# Altium schematic sheet TP_STD_PERIPHERALS.SchDoc
size A4; SheetNumber: 9; SheetTotal: 11
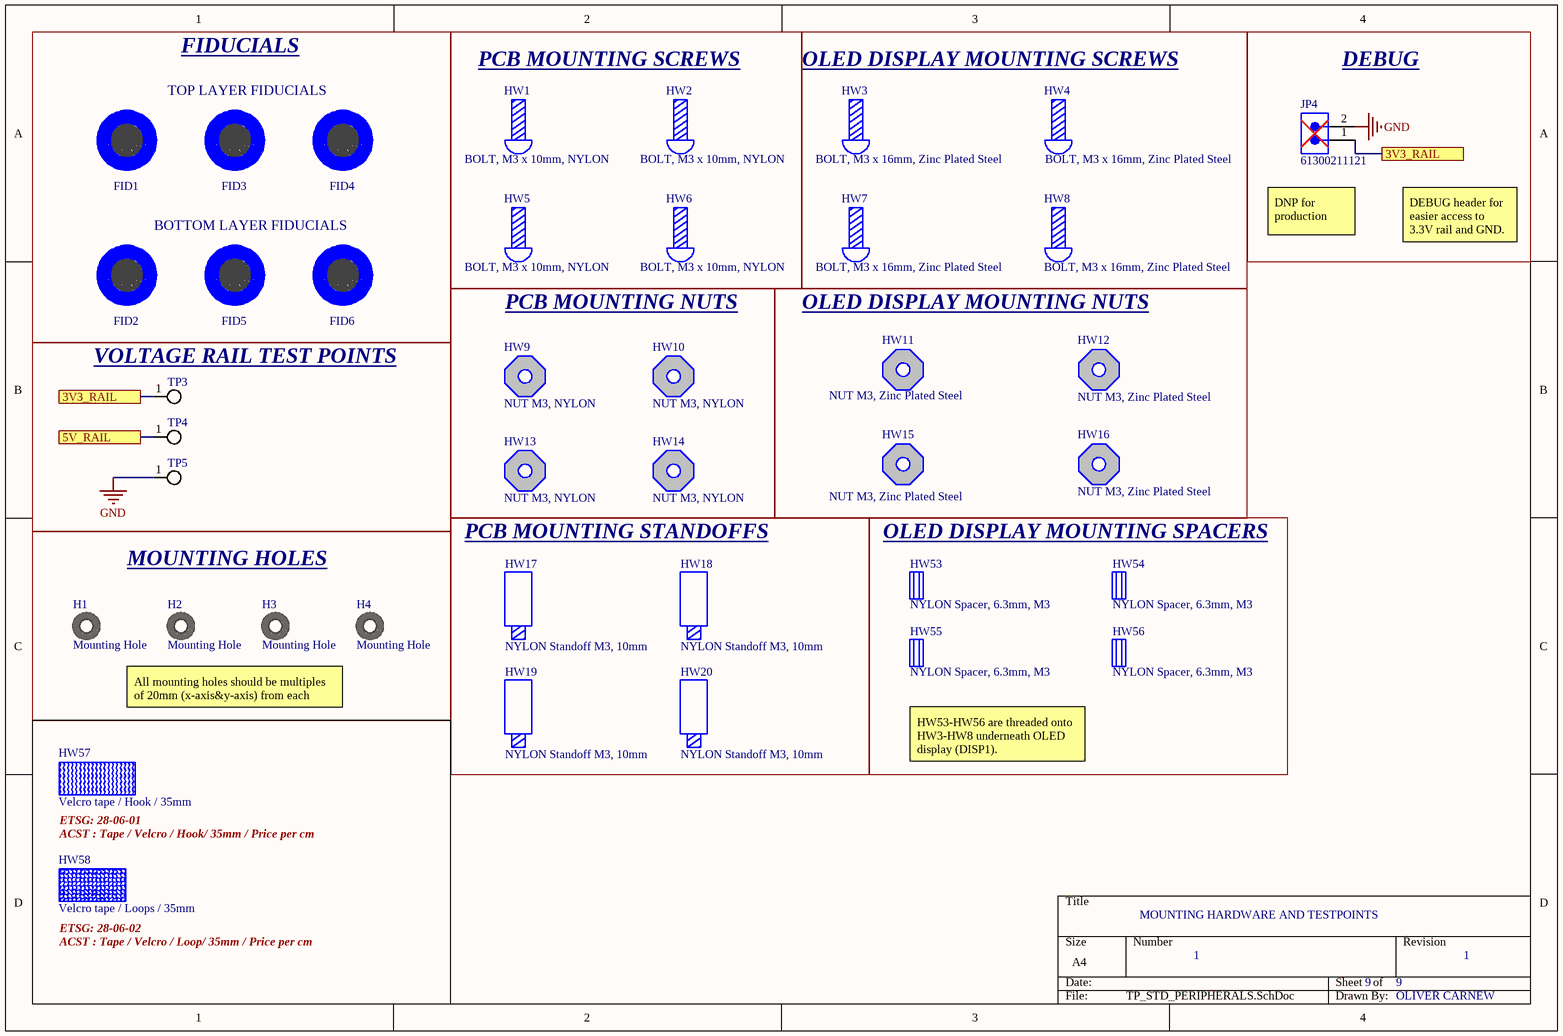
[diagram p0: TP_STD_PERIPHERALS.SchDoc]

## Parts
*  NC  (value not drawn)
FID1  Fiducial Mark  [FIDUCIAL_SMALL]  (value not drawn)
FID2  Fiducial Mark  [FIDUCIAL_SMALL]  (value not drawn)
FID3  Fiducial Mark  [FIDUCIAL_SMALL]  (value not drawn)
FID4  Fiducial Mark  [FIDUCIAL_SMALL]  (value not drawn)
FID5  Fiducial Mark  [FIDUCIAL_SMALL]  (value not drawn)
FID6  Fiducial Mark  [FIDUCIAL_SMALL]  (value not drawn)
H1  Mounting Hole  [M3_MOUNTING_HOLE_3_4_mm]
H2  Mounting Hole  [M3_MOUNTING_HOLE_3_4_mm]
H3  Mounting Hole  [M3_MOUNTING_HOLE_3_4_mm]
H4  Mounting Hole  [M3_MOUNTING_HOLE_3_4_mm]
HW1  BOLT, M3 x 10mm, NYLON
HW2  BOLT, M3 x 10mm, NYLON
HW3  BOLT, M3 x 16mm, Zinc Plated Steel
HW4  BOLT, M3 x 16mm, Zinc Plated Steel
HW5  BOLT, M3 x 10mm, NYLON
HW6  BOLT, M3 x 10mm, NYLON
HW7  BOLT, M3 x 16mm, Zinc Plated Steel
HW8  BOLT, M3 x 16mm, Zinc Plated Steel
HW9  NUT M3, NYLON
HW10  NUT M3, NYLON
HW11  NUT M3, Zinc Plated Steel
HW12  NUT M3, Zinc Plated Steel
HW13  NUT M3, NYLON
HW14  NUT M3, NYLON
HW15  NUT M3, Zinc Plated Steel
HW16  NUT M3, Zinc Plated Steel
HW17  NYLON Standoff M3, 10mm
HW18  NYLON Standoff M3, 10mm
HW19  NYLON Standoff M3, 10mm
HW20  NYLON Standoff M3, 10mm
HW53  NYLON Spacer, 6.3mm, M3
HW54  NYLON Spacer, 6.3mm, M3
HW55  NYLON Spacer, 6.3mm, M3
HW56  NYLON Spacer, 6.3mm, M3
HW57  Velcro tape / Hook / 35mm
HW58  Velcro tape / Loops / 35mm
JP4  61300211121  [61300211121]
TP3  Small testpoint 40mil  [TEST_POINT_SMALL]  (value not drawn)
TP4  Small testpoint 40mil  [TEST_POINT_SMALL]  (value not drawn)
TP5  Small testpoint 40mil  [TEST_POINT_SMALL]  (value not drawn)

## Blocks framed on the sheet
FIDUCIALS: FID1-FID6
PCB MOUNTING SCREWS: HW1 HW2 HW5 HW6
OLED DISPLAY MOUNTING SCREWS: HW3 HW4 HW7 HW8
DEBUG: * JP4
PCB MOUNTING NUTS: HW9 HW10 HW13 HW14
OLED DISPLAY MOUNTING NUTS: HW11 HW12 HW15 HW16
VOLTAGE RAIL TEST POINTS: TP3-TP5
PCB MOUNTING STANDOFFS: HW17-HW20
OLED DISPLAY MOUNTING SPACERS: HW53-HW56
MOUNTING HOLES: H1-H4

## Ports
3V3_RAIL, 5V_RAIL

## Nets
GND: JP4.2 TP5.1
3V3_RAIL: JP4.1 TP3.1 ; port 3V3_RAIL
5V_RAIL: TP4.1 ; port 5V_RAIL

## Notes on the sheet
- TOP LAYER FIDUCIALS
- BOTTOM LAYER FIDUCIALS
- DNP for production
- DEBUG header for easier access to 3.3V rail and GND.
- All mounting holes should be multiples of 20mm (x-axis&y-axis) from each other.
- HW53-HW56 are threaded onto HW3-HW8 underneath OLED display (DISP1).
- (near HW57) ETSG: 28-06-01
- (near HW57) ACST : Tape / Velcro / Hook/ 35mm / Price per cm
- MOUNTING HARDWARE AND TESTPOINTS
- (near HW58) ETSG: 28-06-02
- (near HW58) ACST : Tape / Velcro / Loop/ 35mm / Price per cm
- 1
- 9
- OLIVER CARNEW

## Library data of the parts
FID1-FID6 = FIDUCIAL_SMALL: Small 1mm/40mil pad with 40mm soldermask clearance
H1-H4 = M3_MOUNTING_HOLE: M3 Mounting hole (3.4mm)
HW1-HW8 = M3_SCREW
HW9-HW16 = NUT
HW17-HW20 = STANDOFF
HW53-HW56 = NYLON_STANDOFF_6_3_mm: Spacer / Female - Female / Nylon / Hexagonal / M3 x 06.3
HW57 = VELCRO_HOOKS: ETSG: 28-06-01 / ACST : Tape / Velcro / Hook / / 20mm / Price per cm
HW58 = VELCRO_LOOP: ETSG: 28-06-01 / ACST : Tape / Velcro / Hook / / 20mm / Price per cm
JP4 = CMP-1712-00002-6: NexarPartId: 20081794; Number of Contacts: 2; Pitch: 2.54mm; Connector Type: Male Pin; Voltage Rating: 250V; Current Rating: 3A; Gender: Male; Contact Resistance: 20mΩ; Height: 8.94mm; Lead Free: Lead Free; Number of Pins: 2; Termination: Through Hole; RoHS: Compliant; Lead Pitch: 2.54mm; REACH SVHC: No SVHC; Housing Material: PBT; Contact Mating Length: 5.9944mm; Min Operating Temperature: -40°C; Orientation: Vertical; Contact Material: Copper; Contact Gender: Male; Max Operating Temperature: 125°C; Number of Rows: 1; Number of Positions: 2; Packaging: Bulk; Contact Plating: Gold; Mount: Through Hole; Color: Black; Operating Supply Voltage: 250V
TP3-TP5 = TEST_POINT_SMALL: 40mil circular pad no hole